# EAGLE design pcb_project (EAGLE 9.6.2)
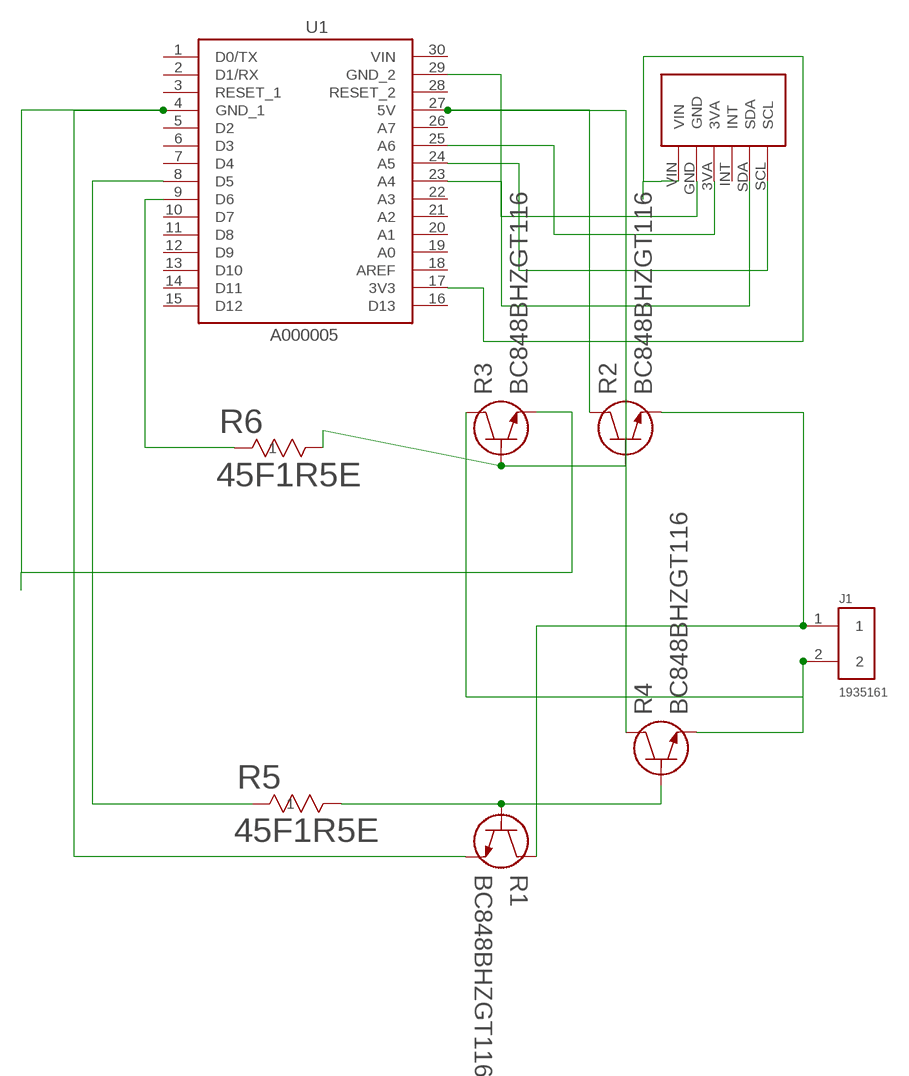
[diagram p0: schematic, sheet 1]

## Parts
J1  1935161  [PHOENIX_1935161]
R1  BC848BHZGT116  [TRANS_BC847BHZGT116_ROM]
R2  BC848BHZGT116  [TRANS_BC847BHZGT116_ROM]
R3  BC848BHZGT116  [TRANS_BC847BHZGT116_ROM]
R4  BC848BHZGT116  [TRANS_BC847BHZGT116_ROM]
R5  45F1R5E  [RES_45_OHM]
R6  45F1R5E  [RES_45_OHM]
U1  A000005  [MODULE_A000005]
U$1  TSL2591  [TSL2591]

## Nets
N$1: U1.25(A6) U$1.3VA
N$2: R2.2 R3.2 R6.2
N$3: U1.24(A5) U$1.SCL
N$4: U1.23(A4) U$1.SDA
N$5: U1.17(3V3) U$1.VIN
N$6: R1.2 R4.2 R5.2
N$7: R6.1 U1.9(D6)
N$8: R5.1 U1.8(D5)
N$9: R2.1 R4.1 U1.27(5V)
N$10: R1.3 R3.3 U1.4(GND_1)
N$11: J1.1 R1.1 R2.3
N$12: J1.2 R3.1 R4.3
N$13: U1.29(GND_2) U$1.GND
Unconnected: U1.1(D0/TX) U1.2(D1/RX) U1.3(RESET_1) U1.5(D2) U1.6(D3) U1.7(D4) U1.10(D7) U1.11(D8) U1.12(D9) U1.13(D10) U1.14(D11) U1.15(D12) U1.16(D13) U1.18(AREF) U1.19(A0) U1.20(A1) U1.21(A2) U1.22(A3) U1.26(A7) U1.28(RESET_2) U$1.INT

## Power pins joined to a net without a drawn wire
VIN: U1.30(VIN)

## Library data of the parts
J1 = 1935161:1935161: Conn Terminal Blocks 2 POS 5mm Solder ST Thru-Hole 16A; DESCRIPTION: 2 Position Wire to Board Terminal Block Horizontal with Board 0.197 (5.00mm) Through Hole; DIGI-KEY_PART_NUMBER: 277-1667-ND; MF: Phoenix Contact; MP: 1935161; PACKAGE: None; PURCHASE-URL: https://pricing.snapeda.com/search/part/1935161/?ref=eda
R1-R4 = transistor_pcb:BC848BHZGT116; BUILT_BY: EMA_Matt; COPYRIGHT: Copyright (C) 2018 Accelerated Designs. All rights reserved; MANUFACTURER_PART_NUMBER: BC848BHZGT116; SOURCELIBRARY: Rohm_2019-09-23; VENDOR: ROHM Semiconductor
R5 R6 = resistor1.5owm:45F1R5E; BUILT_BY: EMA_UL_Team; MANUFACTURER_PART_NUMBER: 45F1R5E; SOURCELIBRARY: Ohmite_2015_05_22; VENDOR: Ohmite
U1 = A000005:A000005: CLOCK SAW OSCILLATOR SEAM7050 T&; DESCRIPTION: ATmega328 Arduino Nano AVR® ATmega AVR MCU 8-Bit Embedded Evaluation Board; DIGI-KEY_PART_NUMBER: 1050-1001-ND; MF: Arduino; MP: A000005; PACKAGE: None; PURCHASE-URL: https://pricing.snapeda.com/search/part/A000005/?ref=eda
U$1 = Adafruit TSL 2591 (1):TSL2591

## Board
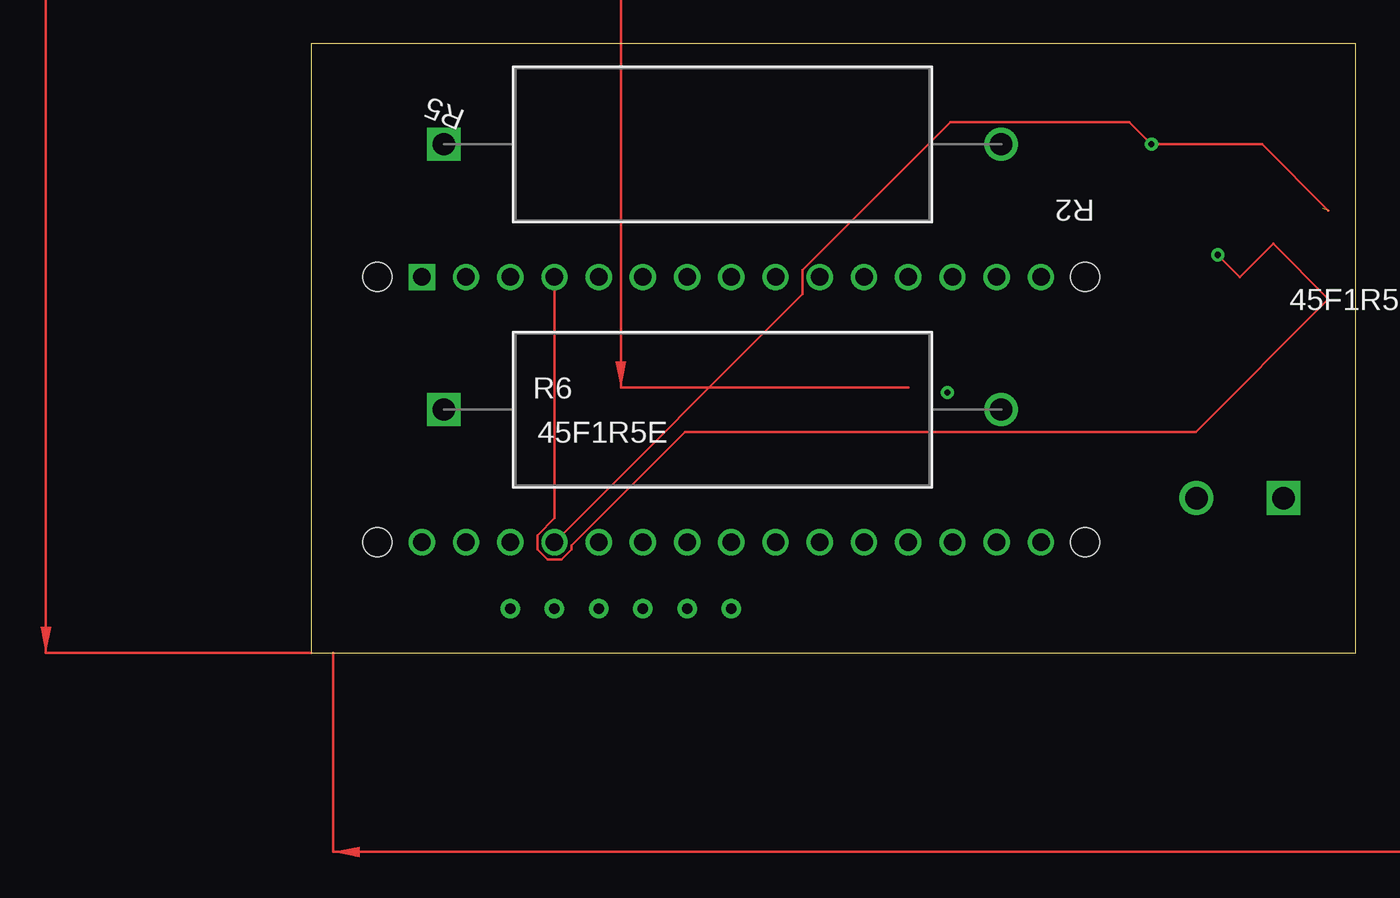
[diagram p1: board, top side]
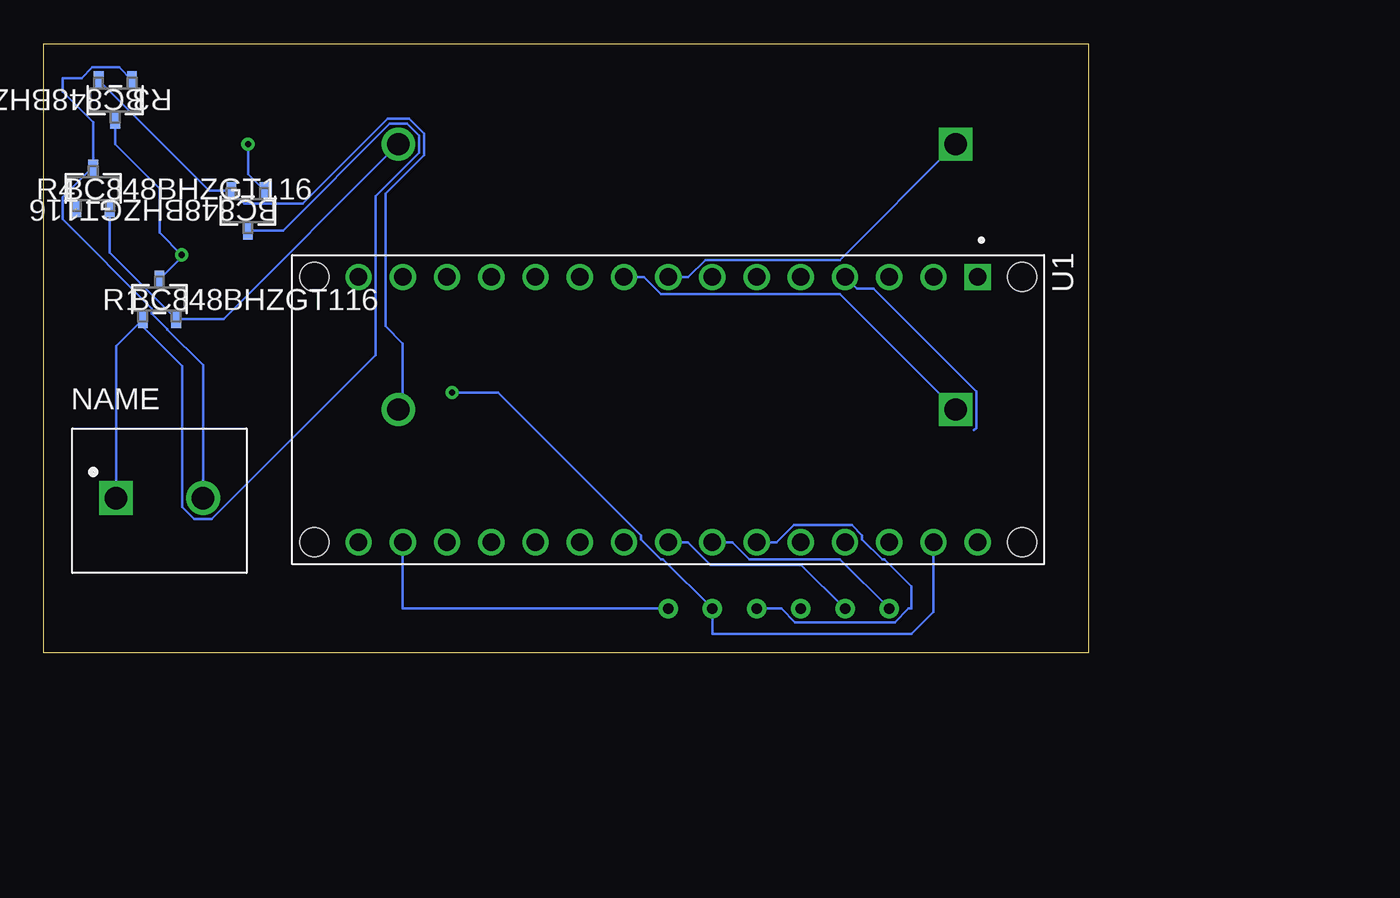
[diagram p2: board, bottom side, seen from below]

Size 60 x 35 mm. Coordinates in mm from the lower left corner, seen from the top.
Outline: 0,0 60,0 60,35 0,35 0,0
Copper layers (1*16): Top 0.035mm / dielectric 1.5mm / Bottom 0.035mm
Design rules "default": minimum track width 6mil, minimum drill 0.35mm, track to track 6mil, track to pad 6mil, pad to pad 6mil, via to via 6mil, smd to smd 6mil, copper to edge 40mil, drill to drill 6mil, minimum pad ring 10mil, minimum via ring 8mil, stop-mask expansion 4mil, vias tented up to drill 0mil, thermal gap 10mil

### Footprints (pad centres in the part's own frame; a part is rotated, then mirrored left to right if it is on the bottom)
PHOENIX_1935161 = drill 1.3 square: 1 -2.5,0 | drill 1.3: 2 2.5,0
TRANS_BC847BHZGT116_ROM = smd 0.559 x 1.016: 1 -0.953,-1.143; 2 0.953,-1.143; 3 0,1.143
RES_45_OHM = drill 1.27 pad 1.778 square: 1 0,0 | drill 1.27 pad 1.778: 2 32.004,0
MODULE_A000005 = drill 1 square: 1 -7.62,17.78 | drill 1: 2 -7.62,15.24; 3 -7.62,12.7; 4 -7.62,10.16; 5 -7.62,7.62; 6 -7.62,5.08; 7 -7.62,2.54; 8 -7.62,0; 9 -7.62,-2.54; 10 -7.62,-5.08; 11 -7.62,-7.62; 12 -7.62,-10.16; 13 -7.62,-12.7; 14 -7.62,-15.24; 15 -7.62,-17.78; 16 7.62,-17.78; 17 7.62,-15.24; 18 7.62,-12.7; 19 7.62,-10.16; 20 7.62,-7.62; 21 7.62,-5.08; 22 7.62,-2.54; 23 7.62,0; 24 7.62,2.54; 25 7.62,5.08; 26 7.62,7.62; 27 7.62,10.16; 28 7.62,12.7; 29 7.62,15.24; 30 7.62,17.78 | hole 1.651: -7.62,-20.32; 7.62,-20.32; -7.62,20.32; 7.62,20.32
TSL2591 = drill 0.6: 3VA 5.08,0; GND 2.54,0; INT 7.62,0; SCL 12.7,0; SDA 10.16,0; VIN 0,0

### Placement (x,y rotation side)
J1  53.34,8.89 0 bottom
R1  53.34,20.32 0 bottom
R2  48.26,25.4 180 bottom
R3  55.88,31.75 180 bottom
R4  57.15,26.67 0 bottom
R5  7.62,29.21 0 top
R6  7.62,13.97 0 top
U1  24.13,13.97 270 bottom
U$1  24.13,2.54 0 bottom

### Tracks (layer width: path | path; a pad name or v marks a point on that pad's centre or on a via)
N$1
  Bottom 0.152: U$1.3VA 17.62,2.54 16.83,1.76 11.11,1.76 10.32,2.54 10.16,2.54 10.16,3.81 11.72,5.37 11.84,5.37 12.99,6.52 12.99,6.76 13.56,7.33 16.92,7.33 17.9,6.35 U1.25
N$2  (via drill 0.35)
  Bottom 0.152: R3.2 50.48,26.54 R2.2 48.48,25.81 45.13,25.81 40.24,30.7 39.01,30.7 38.14,29.82 38.14,28.59 40.35,26.38 40.35,18.76 39.37,17.78 39.37,14.22 R6.2
  other vias: 39.62,13.97
N$3
  Bottom 0.152: U$1.SCL 14.26,5.37 19.46,5.37 20.44,6.35 U1.24
N$4
  Bottom 0.152: U$1.SDA 16.49,5.06 21.69,5.06 22.98,6.35 U1.23
N$5
  Bottom 0.152: U$1.VIN 39.37,2.54 U1.17
N$6
  Bottom 0.152: R4.2 56.2,22.99 R1.2 49.66,19.18 R5.2
N$7
  Bottom 0.152: R6.1 14.26,20.61 24.54,20.61 25.52,21.59 U1.9
N$8
  Bottom 0.152: R5.1 14.26,22.57 22,22.57 22.98,21.59 U1.8
N$9  (via drill 0.35)  (1 unrouted)
  Top 0.152: U1.27 28.23,20.61 28.23,22 36.71,30.48 46.99,30.48 v48.26,29.21 54.61,29.21 58.42,25.4
  Bottom 0.152: v48.26,29.21 48.26,27.5 R2.1
N$10  (via drill 0.35)
  Top 0.152: U1.4 13.97,7.74 12.99,6.76 12.99,5.94 13.56,5.37 14.38,5.37 14.95,5.94 14.95,6.18 21.47,12.7 50.8,12.7 58.42,20.32 55.24,23.5 53.34,21.59 v52.07,22.86
  Bottom 0.152: 6.57,12.79 6.44,12.92 6.44,15.02 12.33,20.91 13.29,20.91 U1.4 | R3.3 55.88,29.21 53.34,26.67 53.34,24.13 v52.07,22.86 52.07,22.73 R1.3
N$11
  Bottom 0.152: J1.1 55.84,17.63 54.52,18.95 | 54.52,18.95 R1.1 | 54.52,18.95 52.04,16.48 52.04,8.39 51.34,7.69 50.34,7.69 40.93,17.1 40.93,26.24 38.44,28.72 38.44,29.7 39.13,30.39 40.11,30.39 46.25,24.26 R2.3
N$12
  Bottom 0.152: R4.3 57.15,27.94 | 57.15,27.94 57.15,30.48 58.91,32.24 58.91,33.02 57.82,33.02 57.21,33.63 55.66,33.63 R3.1 | J1.2 50.84,16.52 52.9,18.57 52.9,18.61 53.78,19.49 53.78,19.78 58.91,24.9 58.91,26.18 57.15,27.94
N$13  (via drill 0.35)
  Bottom 0.152: U1.29 8.89,2.36 10.16,1.09 21.59,1.09 U$1.GND 24.42,5.37 24.54,5.37 25.69,6.52 25.69,6.76 33.88,14.95 v36.54,14.95
(copper drawn outside any net)
  shapes: Top area x3